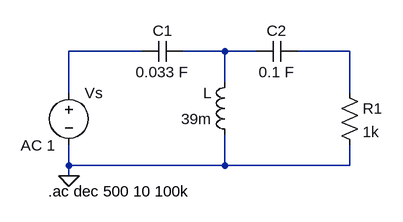
[diagram p0: schematic ButHi.asc]
ButHi.asc, the LTspice schematic file:
Version 4
SHEET 1 880 680
WIRE 112 48 0 48
WIRE 240 48 176 48
WIRE 288 48 240 48
WIRE 432 48 352 48
WIRE 240 96 240 48
WIRE 0 112 0 48
WIRE 432 112 432 48
WIRE 0 224 0 192
WIRE 240 224 240 176
WIRE 240 224 0 224
WIRE 432 224 432 192
WIRE 432 224 240 224
WIRE 0 240 0 224
FLAG 0 240 0
SYMBOL voltage 0 96 R0
WINDOW 123 -74 97 Left 2
WINDOW 39 0 0 Left 2
WINDOW 3 24 152 Left 2
SYMATTR Value2 AC 1
SYMATTR Value ""
SYMATTR InstName Vs
SYMBOL ind 256 192 R180
WINDOW 0 36 80 Left 2
WINDOW 3 36 40 Left 2
SYMATTR InstName L
SYMATTR Value 39m
SYMBOL res 416 96 R0
SYMATTR InstName R1
SYMATTR Value 1k
SYMBOL cap 352 32 R90
WINDOW 0 0 32 VBottom 2
WINDOW 3 32 32 VTop 2
SYMATTR InstName C2
SYMATTR Value 0.1 F
SYMBOL cap 176 32 R90
WINDOW 0 0 32 VBottom 2
WINDOW 3 32 32 VTop 2
SYMATTR InstName C1
SYMATTR Value 0.033 F
TEXT -32 264 Left 2 !.ac dec 500 10 100k

The netlist it stands for:
* ButHi.asc
Vs N001 0 AC 1
L 0 N002 39m
R1 N003 0 1k
C2 N003 N002 0.1 F
C1 N002 N001 0.033 F
.ac dec 500 10 100k
.backanno
.end